# Altium schematic sheet peripherals.SchDoc
size A4; SheetNumber: 2; SheetTotal: 2
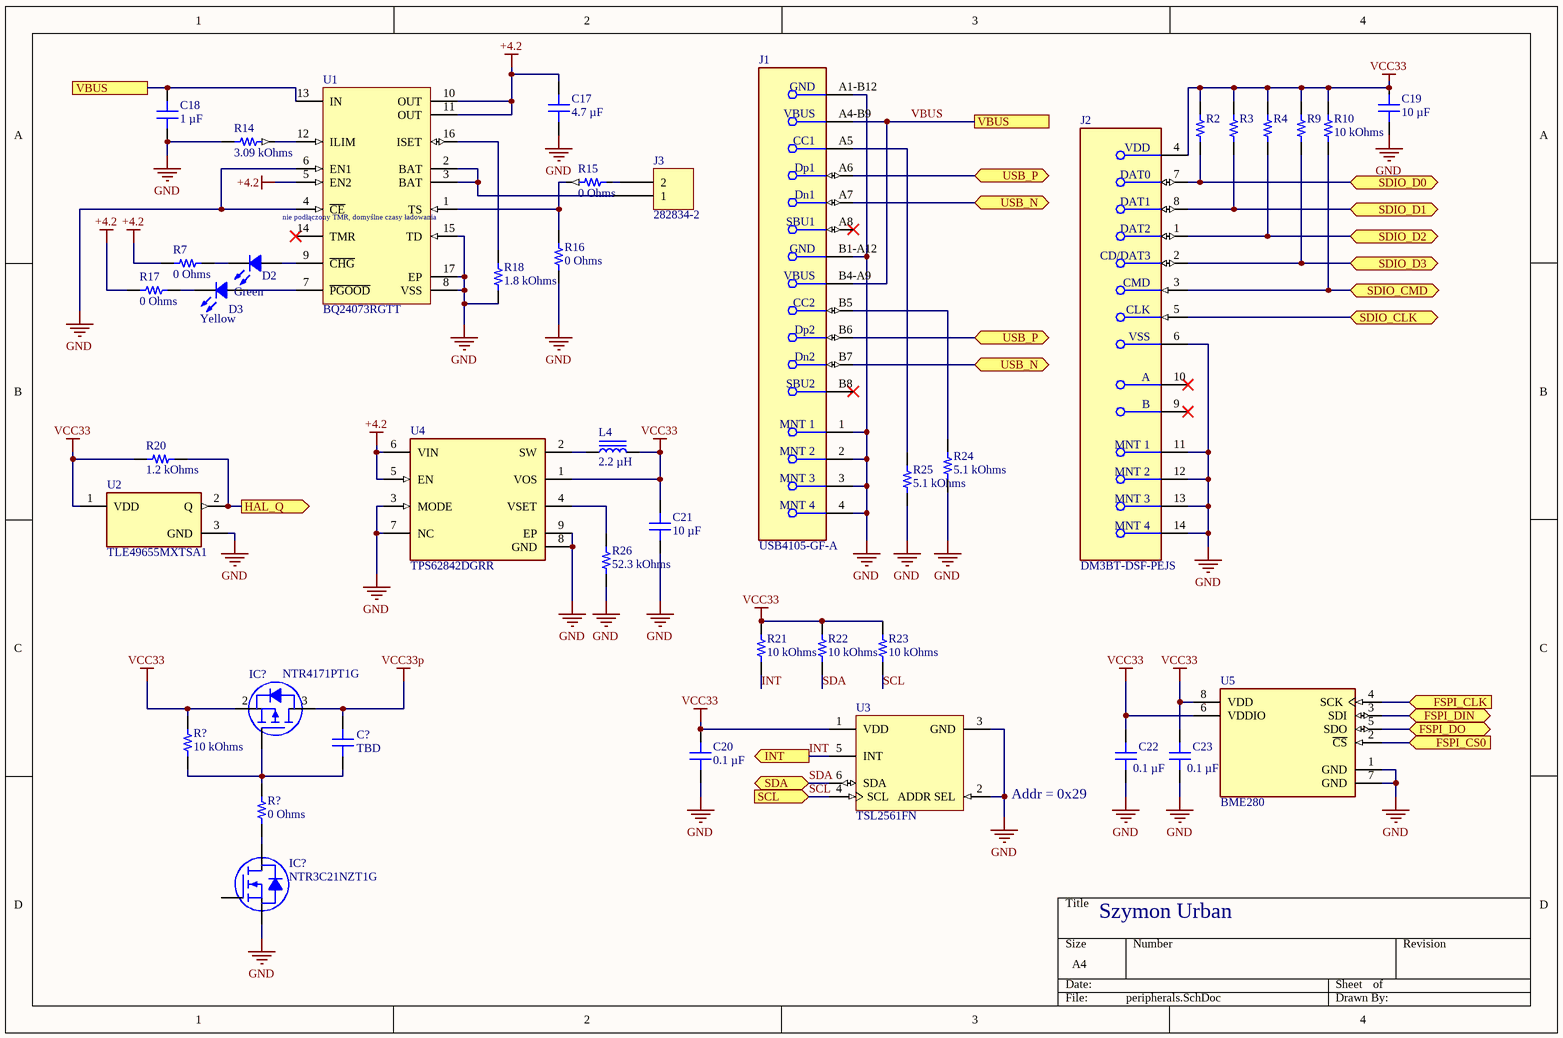
[diagram p0: peripherals.SchDoc]

## Parts
(Parts that share a designator on the sheet are numbered #1, #2 ... from top to bottom, then left to right.)
C17  4.7 µF  [CAP 0603_1608]
C18  1 µF  [CAP 0603_1608]
C19  10 µF  [CAP 0603_1608]
C20  0.1 µF  [CAP 0603_1608]
C21  10 µF  [CAP 0603_1608]
C22  0.1 µF  [CAP 0603_1608]
C23  0.1 µF  [CAP 0603_1608]
C?  TBD  [CAP 0402_1005]
D2  Green  [LED 0805_2012 GREEN]
D3  Yellow  [LED 0805_2012 YELLOW]
IC?#1  NTR4171PT1G  [ON SEMI SOT-23-3]
IC?#2  NTR3C21NZT1G  [ON SEMI SOT-23-3]
J1  USB4105-GF-A  [FP-USB4105-GF-A-MFG]
J2  DM3BT-DSF-PEJS  [FP-DM3BT-DSF-PEJS-MFG]
J3  282834-2  [TE 282834-2]
L4  2.2 µH  [IND 0402_1005 RF WW]
R2  10 kOhms  [RES 0603_1608]  (value not drawn)
R3  10 kOhms  [RES 0603_1608]  (value not drawn)
R4  10 kOhms  [RES 0603_1608]  (value not drawn)
R7  0 Ohms  [RES 0603_1608]
R9  10 kOhms  [RES 0603_1608]  (value not drawn)
R10  10 kOhms  [RES 0603_1608]
R14  3.09 kOhms  [RES 0603_1608]
R15  0 Ohms  [RES 0603_1608]
R16  0 Ohms  [RES 0603_1608]
R17  0 Ohms  [RES 0603_1608]
R18  1.8 kOhms  [RES 0603_1608]
R20  1.2 kOhms  [RES 0603_1608]
R21  10 kOhms  [RES 0603_1608]
R22  10 kOhms  [RES 0603_1608]
R23  10 kOhms  [RES 0603_1608]
R24  5.1 kOhms  [RES 0603_1608]
R25  5.1 kOhms  [RES 0603_1608]
R26  52.3 kOhms  [RES 0603_1608]
R?#1  10 kOhms  [RES 0603_1608]
R?#2  0 Ohms  [RES 0603_1608]
U1  BQ24073RGTT  [RGT0016C_V]
U2  TLE49655MXTSA1  [FP-PG-SOT23-3-MFG]
U3  TSL2561FN  [AMS-FN-6-2000X2000DE_V]
U4  TPS62842DGRR  [FP-DGR0008A-MFG]
U5  BME280  [FP-BME280-MFG]

## Ports
FSPI_CLK (in, see MCU[1D]), FSPI_CS0 (in, see MCU[3C]), FSPI_DIN (bidir, see MCU[1C]), FSPI_DO (bidir, see MCU[1D]), HAL_Q (out, see MCU[3C]), INT (out, see MCU[1D]), SCL (in, see MCU[1D]), SDA (bidir, see MCU[1D]), SDIO_CLK (bidir, see MCU[3B]), SDIO_CMD (bidir, see MCU[3B]), SDIO_D0 (bidir, see MCU[3B]), SDIO_D1 (bidir, see MCU[3B]), SDIO_D2 (bidir, see MCU[3B]), SDIO_D3 (bidir, see MCU[3A]), USB_N (bidir, see MCU[1D], peripherals[3A]), USB_N (bidir, see MCU[1D], peripherals[3B]), USB_P (bidir, see MCU[3C], peripherals[3A]), USB_P (bidir, see MCU[3C], peripherals[3B]), VBUS (see MCU[1D], peripherals[1A]), VBUS (see MCU[1D], peripherals[3A])

## Nets
+4.2: C17.2 R7.2 R17.2 U1.5(EN2) U1.10(OUT) U1.11(OUT) U4.5(EN) U4.6(VIN)
GND: C17.1 C18.1 C19.2 C20.1 C21.2 C22.1 C23.1 IC?#2.2(S) J1.1(MNT_1) J1.2(MNT_2) J1.3(MNT_3) J1.4(MNT_4) J1.A1-B12(GND) J1.B1-A12(GND) J2.6(VSS) J2.11(MNT_1) J2.12(MNT_2) J2.13(MNT_3) J2.14(MNT_4) R14.1 R16.1 R18.1 R24.1 R25.1 R26.1 U1.4(~{CE}) U1.6(EN1) U1.8(VSS) U1.15(TD) U1.17(EP) U2.3(GND) U3.2(ADDR_SEL) U3.3(GND) U4.3(MODE) U4.7(NC) U4.8(GND) U4.9(EP) U5.1(GND) U5.7(GND)
VCC33: C19.1 C20.2 C21.1 C22.2 C23.2 IC?#1.2(S) J2.4(VDD) L4.2 R2.2 R3.2 R4.2 R9.2 R10.2 R20.1 R21.2 R22.2 R23.2 R?#1.2 U2.1(VDD) U3.1(VDD) U4.1(VOS) U5.6(VDDIO) U5.8(VDD)
VCC33p: C?.2 IC?#1.3(D)
FSPI_CLK: U5.4(SCK) ; port FSPI_CLK
FSPI_CS0: U5.2(~{CS}) ; port FSPI_CS0
FSPI_DIN: U5.3(SDI) ; port FSPI_DIN
FSPI_DO: U5.5(SDO) ; port FSPI_DO
HAL_Q: R20.2 U2.2(Q) ; port HAL_Q
INT: R21.1 U3.5(INT) ; port INT
SCL: R23.1 U3.4(SCL) ; port SCL
SDA: R22.1 U3.6(SDA) ; port SDA
SDIO_CLK: J2.5(CLK) ; port SDIO_CLK
SDIO_CMD: J2.3(CMD) R10.1 ; port SDIO_CMD
SDIO_D0: J2.7(DAT0) R2.1 ; port SDIO_D0
SDIO_D1: J2.8(DAT1) R3.1 ; port SDIO_D1
SDIO_D2: J2.1(DAT2) R4.1 ; port SDIO_D2
SDIO_D3: J2.2(CD/DAT3) R9.1 ; port SDIO_D3
USB_N: J1.A7(Dn1) J1.B7(Dn2) ; port USB_N
USB_P: J1.A6(Dp1) J1.B6(Dp2) ; port USB_P
VBUS: C18.2 J1.A4-B9(VBUS) J1.B4-A9(VBUS) U1.13(IN) ; port VBUS
NetC?_1: C?.1 IC?#1.1(G) R?#1.1 R?#2.2
NetD2_1: D2.1 U1.9(~{CHG})
NetD2_2: D2.2 R7.1
NetD3_1: D3.1 U1.7(~{PGOOD})
NetD3_2: D3.2 R17.1
NetIC?#2_3: IC?#2.3(D) R?#2.1
NetJ1_A5: J1.A5(CC1) R25.2
NetJ1_B5: J1.B5(CC2) R24.2
NetJ3_1: J3.1 U1.2(BAT) U1.3(BAT)
NetJ3_2: J3.2 R15.2
NetL4_1: L4.1 U4.2(SW)
NetR14_2: R14.2 U1.12(ILIM)
NetR15_1: R15.1 R16.2 U1.1(TS)
NetR18_2: R18.2 U1.16(ISET)
NetR26_2: R26.2 U4.4(VSET)

Not connected (* = marked no-connect by the designer): IC?#2 1(G); J1 A8(SBU1)* B8(SBU2)*; J2 9(B)* 10(A)*; U1 14(TMR)*

## Notes on the sheet
- (near U1) nie podłączony TMR, domyślne czasy ładowania
- Addr = 0x29
- Szymon Urban

## Library data of the parts
C17 = GRM188R61C475KE11D: CAP CER 4.7UF 16V X5R 0603; manufacturer: Murata Electronics; Tolerance: ±10%; Part Number: GRM188R61C475KE11D; Value: 4.7 µF; Applications: General Purpose; Capacitance: 4.7 µF; componentlink1description: Datasheet; componentlink1url: https://search.murata.co.jp/Ceramy/image/img/A01X/G101/ENG/GRM188R61C475KE11-01.pdf; componentlink2description: DigiKey Link; componentlink2url: https://www.digikey.com/en/products/detail/murata-electronics/GRM188R61C475KE11D/4905341; Device Package: 0603 (1608 Metric); lastupdated: 15.01.2024 20:10:04; Lifecycle Status: Active; Minimum Order: 1; Mounting Type: Surface Mount, MLCC; Operating Temperature: -55°C ~ 85°C; Package / Case: 0603 (1608 Metric); packaging: TapeAndReel; partid: 2388; Part Status: Active; price: 0.03; series: GRM; Size / Dimension: 0.063" L x 0.031" W (1.60mm x 0.80mm); Supplier 1: DigiKey; Supplier Part Number 1: 490-10730-1-ND; Temperature Coefficient: X5R; Thickness (Max): 0.037" (0.95mm); Voltage - Rated: 16V
C18 = CC0603KRX7R6BB105: CAP CER 1UF 10V X7R 0603; manufacturer: Yageo; Tolerance: ±10%; Part Number: CC0603KRX7R6BB105; Value: 1 µF; Applications: General Purpose; Capacitance: 1 µF; componentlink1description: Datasheet; componentlink1url: https://www.yageo.com/upload/media/product/productsearch/datasheet/mlcc/UPY-GPHC_X7R_6.3V-to-50V_18.pdf; componentlink2description: DigiKey Link; componentlink2url: https://www.digikey.com/en/products/detail/yageo/CC0603KRX7R6BB105/5195204; Device Package: 0603 (1608 Metric); lastupdated: 15.01.2024 20:10:05; Lifecycle Status: Active; Minimum Order: 1; Mounting Type: Surface Mount, MLCC; Operating Temperature: -55°C ~ 125°C; Package / Case: 0603 (1608 Metric); packaging: TapeAndReel; partid: 2290; Part Status: Active; price: 0.01; series: CC; Size / Dimension: 0.063" L x 0.031" W (1.60mm x 0.80mm); Supplier 1: DigiKey; Supplier Part Number 1: 311-1796-1-ND; Temperature Coefficient: X7R; Thickness (Max): 0.035" (0.90mm); Voltage - Rated: 10V
C19 C21 = GRM188D71A106KA73D: CAP CER 10UF 10V X7T 0603; manufacturer: Murata Electronics; Tolerance: ±10%; Part Number: GRM188D71A106KA73D; Value: 10 µF; Applications: General Purpose; Capacitance: 10 µF; componentlink1description: Datasheet; componentlink1url: https://search.murata.co.jp/Ceramy/image/img/A01X/G101/ENG/GRM188D71A106KA73-01.pdf; componentlink2description: DigiKey Link; componentlink2url: https://www.digikey.com/en/products/detail/murata-electronics/GRM188D71A106KA73D/6606090; Device Package: 0603 (1608 Metric); lastupdated: 15.01.2024 20:10:04; Lifecycle Status: Active; Minimum Order: 1; Mounting Type: Surface Mount, MLCC; Operating Temperature: -55°C ~ 125°C; Package / Case: 0603 (1608 Metric); packaging: TapeAndReel; partid: 2489; Part Status: Active; price: 0.03; series: GRM; Size / Dimension: 0.063" L x 0.031" W (1.60mm x 0.80mm); Supplier 1: DigiKey; Supplier Part Number 1: 490-14461-1-ND; Temperature Coefficient: X7T; Thickness (Max): 0.039" (1.00mm); Voltage - Rated: 10V
C20 C22 C23 = CS0603KRX7R7BB104: CAP CER 0.1UF 16V X7R 0603; manufacturer: Yageo; Tolerance: ±10%; Part Number: CS0603KRX7R7BB104; Value: 0.1 µF; Applications: Boardflex Sensitive; Capacitance: 0.1 µF; componentlink1description: Datasheet; componentlink1url: http://www.yageo.com/NewPortal/yageodocoutput?fileName=/pdf/MLCC/UPY-ST_NPOX7R_16V-to-3KV_5.pdf; componentlink2description: DigiKey Link; componentlink2url: https://www.digikey.com/en/products/detail/yageo/CS0603KRX7R7BB104/6097897; Device Package: 0603 (1608 Metric); Features: Soft Termination; lastupdated: 15.01.2024 20:10:05; Lifecycle Status: Active; Minimum Order: 1; Mounting Type: Surface Mount, MLCC; Operating Temperature: -55°C ~ 125°C; Package / Case: 0603 (1608 Metric); packaging: TapeAndReel; partid: 2286; Part Status: Active; price: 0.01; series: CS; Size / Dimension: 0.063" L x 0.031" W (1.60mm x 0.80mm); Supplier 1: DigiKey; Supplier Part Number 1: 311-3560-1-ND; Temperature Coefficient: X7R; Thickness (Max): 0.037" (0.95mm); Voltage - Rated: 16V
C? = 04023A6R8CAT2A: CAP CER 6.8PF 25V C0G/NP0 0402; manufacturer: AVX Corporation; Temperature Coefficient: C0G, NP0; Tolerance: ±0.25pF; Part Number: 04023A6R8CAT2A; Value: TBD; Applications: General Purpose; Capacitance: 6.8pF; componentlink1description: Datasheet; componentlink1url: http://datasheets.avx.com/C0GNP0-Dielectric.pdf; componentlink2description: DigiKey Link; componentlink2url: http://digikey.com/product-detail/en/avx-corporation/04023A6R8CAT2A/478-12617-1-ND/9949155; Device Package: 0402 (1005 Metric); lastupdated: 08.02.2022 12:26:50; Lifecycle Status: Active; Minimum Order: 1; Mounting Type: Surface Mount, MLCC; Operating Temperature: -55°C ~ 125°C; Package / Case: 0402 (1005 Metric); packaging: TapeAndReel; partid: 6987; Part Status: Active; price: 0.06; series: -; Size / Dimension: 0.039" L x 0.020" W (1.00mm x 0.50mm); Supplier 1: DigiKey; Supplier Part Number 1: 478-12617-1-ND; Thickness (Max): 0.022" (0.56mm); Voltage - Rated: 25V
D2 = 150080VS75000: LED GREEN CLEAR 0805 SMD; Manufacturer: Würth Elektronik; Configuration: Standard; Current - Test: 20mA; Lens Color: Colorless; Lens Size: 1.40mm x 1.25mm; Lens Style: Rectangle with Flat Top; Millicandela Rating: 40mcd; Viewing Angle: 140°; Voltage - Forward (Vf) (Typ): 2V; Wavelength - Dominant: 570nm; Wavelength - Peak: 572nm; Part Number: 150080VS75000; Color: Green; ComponentLink1Description: Datasheet; ComponentLink1URL: https://katalog.we-online.de/led/datasheet/150080VS75000.pdf; ComponentLink2Description: DigiKey Link; ComponentLink2URL: https://www.digikey.com/en/products/detail/würth-elektronik/150080VS75000/4489924; Device Package: 0805 (2012 Metric); Height (Max): 0.80mm; LastUpdated: 15.01.2024 21:31:06; Lens Transparency: Clear; Lifecycle Status: Active; Minimum Order: 1; Mounting Type: Surface Mount; Package / Case: 0805 (2012 Metric); Packaging: TapeAndReel; PartId: 300; Part Status: Active; Price: 0.13; Series: WL-SMCW; Size / Dimension: 2.00mm L x 1.25mm W; Supplier 1: DigiKey; Supplier Part Number 1: 732-4986-1-ND; Supplier Device Package: 0805; Value: Green
D3 = 150080YS75000: LED YELLOW CLEAR 0805 SMD; Manufacturer: Würth Elektronik; Configuration: Standard; Current - Test: 20mA; Lens Color: Colorless; Lens Size: 1.40mm x 1.25mm; Lens Style: Rectangle with Flat Top; Millicandela Rating: 120mcd; Viewing Angle: 140°; Voltage - Forward (Vf) (Typ): 2V; Wavelength - Dominant: 590nm; Wavelength - Peak: 595nm; Part Number: 150080YS75000; Color: Yellow; ComponentLink1Description: Datasheet; ComponentLink1URL: https://katalog.we-online.de/led/datasheet/150080YS75000.pdf; ComponentLink2Description: DigiKey Link; ComponentLink2URL: https://www.digikey.com/en/products/detail/würth-elektronik/150080YS75000/4489927; Device Package: 0805 (2012 Metric); Height (Max): 0.80mm; LastUpdated: 15.01.2024 21:32:02; Lens Transparency: Clear; Lifecycle Status: Active; Minimum Order: 1; Mounting Type: Surface Mount; Package / Case: 0805 (2012 Metric); Packaging: TapeAndReel; PartId: 56; Part Status: Active; Price: 0.13; Series: WL-SMCW; Size / Dimension: 2.00mm L x 1.25mm W; Supplier 1: DigiKey; Supplier Part Number 1: 732-4987-1-ND; Supplier Device Package: 0805; Value: Yellow
IC?#1 = NTR4171PT1G: MOSFET P-CH 30V 2.2A SOT23; Manufacturer: ON Semiconductor; Current - Continuous Drain (Id) @ 25°C: 2.2A (Ta); Drive Voltage (Max Rds On,  Min Rds On): 2.5V, 10V; FET Type: P-Channel; Gate Charge (Qg) (Max) @ Vgs: 15.6nC @ 10V; Input Capacitance (Ciss) (Max) @ Vds: 720pF @ 15V; Power Dissipation (Max): 480mW (Ta); Rds On (Max) @ Id, Vgs: 75mOhm @ 2.2A, 10V; Vgs (Max): ±12V; Vgs(th) (Max) @ Id: 1.4V @ 250µA; Part Number: NTR4171PT1G; ComponentLink1Description: Datasheet; ComponentLink1URL: http://www.onsemi.com/pub/Collateral/NTR4171P-D.PDF; ComponentLink2Description: DigiKey Link; ComponentLink2URL: http://digikey.com/product-detail/en/on-semiconductor/NTR4171PT1G/NTR4171PT1GOSCT-ND/2705209; Drain to Source Voltage (Vdss): 30V; LastUpdated: 08.02.2024 21:46:19; Lifecycle Status: Active; Minimum Order: 1; Mounting Type: Surface Mount; Operating Temperature: -55°C ~ 150°C (TJ); Package / Case: TO-236-3, SC-59, SOT-23-3; Packaging: TapeAndReel; Part Status: Active; Price: 0.10; Series: -; Supplier 1: DigiKey; Supplier Part Number 1: NTR4171PT1GOSCT-ND; Supplier Device Package: SOT-23-3 (TO-236); Technology: MOSFET (Metal Oxide)
IC?#2 = NTR3C21NZT1G: MOSFET N-CH 20V 3.6A SOT23-3; Manufacturer: ON Semiconductor; Current - Continuous Drain (Id) @ 25°C: 3.6A (Ta); Drive Voltage (Max Rds On,  Min Rds On): 1.8V, 4.5V; FET Type: N-Channel; Gate Charge (Qg) (Max) @ Vgs: 17.8nC @ 4.5V; Input Capacitance (Ciss) (Max) @ Vds: 1540pF @ 16V; Power Dissipation (Max): 470mW (Ta); Rds On (Max) @ Id, Vgs: 24mOhm @ 5A, 4.5V; Vgs (Max): ±8V; Vgs(th) (Max) @ Id: 1V @ 250µA; Part Number: NTR3C21NZT1G; ComponentLink1Description: Datasheet; ComponentLink1URL: http://www.onsemi.com/pub/Collateral/NTR3C21NZ-D.PDF; ComponentLink2Description: DigiKey Link; ComponentLink2URL: http://digikey.com/product-detail/en/on-semiconductor/NTR3C21NZT1G/NTR3C21NZT1GOSCT-ND/9087577; Drain to Source Voltage (Vdss): 20V; LastUpdated: 08.02.2024 21:46:18; Lifecycle Status: Active; Minimum Order: 1; Mounting Type: Surface Mount; Operating Temperature: -55°C ~ 150°C (TJ); Package / Case: TO-236-3, SC-59, SOT-23-3; Packaging: TapeAndReel; Part Status: Active; Price: 0.10; Series: -; Supplier 1: DigiKey; Supplier Part Number 1: NTR3C21NZT1GOSCT-ND; Supplier Device Package: SOT-23-3 (TO-236); Technology: MOSFET (Metal Oxide)
J1 = CMP-245163-000001-1: CONN RCPT USB2.0 TYPEC 5A; Manufacturer: GCT; Voltage Rating: 20V; Is Female: yes; Current Rating: 5/6.25/1.25/0.25A; Number Of Contacts: 16; Conn Orientation: Right Angle; Device Class L1: Connectors; Category: Conn; Lead Free: Yes; RoHS: TRUE; Temperature Range High: +85°C; Digikey Description: CONN RCPT USB2.0 TYPEC 5A; Device Class L3: unset; ComponentLink2Description: Datasheet; Manufacturer Part Number: USB4105-GF-A; Package: 0; Usb Standard: USB 2.0; Device Class L2: USB Connectors; Automotive: No; Temperature Range Low: -40°C; Height: 3.46mm; Temperature: -40°C to +85°C; Contact Material: Gold,Nickel; ComponentLink2URL: https://gct.co/files/drawings/usb4105.pdf; Octopart: https://octopart.com/usb4105-gf-a-gct-106627878
J2 = CMP-11597-000004-1: CONN MICRO SD CARD PUSH-PUSH R/A; Connector Type: Connector; Pitch: 1.1mm; Insulation Resistance: 1GR; Contact Resistance: 100mR; Number of Positions: 8; Max Voltage Rating (AC): 125V; Gender: Female; Current Rating: 500mA; Flammability Rating: UL94 V-0; Min Operating Temperature: -25°C; Lead Free: Lead Free; Length: 13.85mm; Radiation Hardening: No; Orientation: Right Angle; Mount: Surface Mount; Housing Material: Polymer; Contact Material: Copper Alloy; Package Quantity: 1; Contact Plating: Gold; Termination: Solder; Max Operating Temperature: 85°C; Number of Contacts: 8; Voltage Rating (AC): 125V; REACH SVHC: No SVHC; Depth: 1.83mm; Max Current Rating: 500mA; Width: 16.05mm; Number of Rows: 1; Packaging: Tape and Reel
J3 = 282834-2: TERM BLK 2P SIDE ENT 2.54MM PCB; Manufacturer: TE Connectivity AMP Connectors; Current: 10A; Mating Orientation: Horizontal with Board; Number of Levels: 1; Pitch: 0.100" (2.54mm); Positions Per Level: 2; Voltage: 150V; Wire Gauge: 16-30 AWG; Wire Termination: Screw - Rising Cage Clamp; Part Number: 282834-2; Color: Green; ComponentLink1Description: Datasheet; ComponentLink1URL: https://www.te.com/commerce/DocumentDelivery/DDEController?Action=srchrtrv&DocNm=282834&DocType=Customer+Drawing&DocLang=English; ComponentLink2Description: DigiKey Link; ComponentLink2URL: http://digikey.com/product-detail/en/te-connectivity-amp-connectors/282834-2/A98333-ND/1150135; LastUpdated: 15.01.2020 04:15:38; Lifecycle Status: Active; Minimum Order: 1; Mounting Type: Through Hole; Packaging: Bulk; Part Status: Active; Price: 0.88; Series: Buchanan; Supplier 1: DigiKey; Supplier Part Number 1: A98333-ND
L4 = LQW15CE2R2M10D: FIXED IND 2.2UH 85MA 1.8OHM SMD; Manufacturer: Murata Electronics; DC Resistance (DCR): 1.8Ohm Max; Frequency - Self Resonant: 100MHz; Inductance Frequency - Test: 1 MHz; Material - Core: Ferrite; Shielding: Unshielded; Tolerance: ±20%; Type: Drum Core, Wirewound; Part Number: LQW15CE2R2M10D; ComponentLink1Description: Datasheet; ComponentLink1URL: https://search.murata.co.jp/Ceramy/image/img/P02/JELF243A-0187.pdf; ComponentLink2Description: DigiKey Link; ComponentLink2URL: https://www.digikey.com/en/products/detail/murata-electronics/LQW15CE2R2M10D/15843704; Current Rating (Amps): 85 mA; Device Package: 0402 (1005 Metric); Height - Seated (Max): 0.024" (0.60mm); Inductance: 2.2 µH; LastUpdated: 15.01.2024 21:33:44; Lifecycle Status: Active; Minimum Order: 1; Mounting Type: Surface Mount; Operating Temperature: -55°C ~ 125°C; Package / Case: 0402 (1005 Metric); Packaging: TapeAndReel; PartId: 1541; Part Status: Active; Price: 0.07; Series: LQW15; Size / Dimension: 0.039" L x 0.024" W (1.00mm x 0.60mm); Supplier 1: DigiKey; Supplier Part Number 1: 490-LQW15CE2R2M10DDKR-ND; Supplier Device Package: 0402; Value: 2.2 µH
R2-R4 R9 R10 R21-R23 = RT0603FRE0710KL: RES SMD 10K OHM 1% 1/10W 0603; Manufacturer: Yageo; Power (Watts): 0.1W, 1/10W; Temperature Coefficient: ±50ppm/°C; Part Number: RT0603FRE0710KL; Value: 10 kOhms; ComponentLink1Description: Datasheet; ComponentLink1URL: https://www.yageo.com/upload/media/product/productsearch/datasheet/rchip/PYu-RT_1-to-0.01_RoHS_L_11.pdf; ComponentLink2Description: DigiKey Link; ComponentLink2URL: https://www.digikey.com/en/products/detail/yageo/RT0603FRE0710KL/1075040; Composition: Thin Film; Device Package: 0603 (1608 Metric); Height - Seated (Max): 0.022" (0.55mm); LastUpdated: 15.01.2024 20:40:25; Lifecycle Status: Active; Minimum Order: 1; Number of Terminations: 2; Operating Temperature: -55°C ~ 155°C; Package / Case: 0603 (1608 Metric); Packaging: TapeAndReel; PartId: 5671; Part Status: Active; Price: 0.01; Resistance: 10 kOhms; Series: RT; Size / Dimension: 0.063" L x 0.031" W (1.60mm x 0.80mm); Supplier 1: DigiKey; Supplier Part Number 1: YAG2321CT-ND; Supplier Device Package: 0603; Tolerance: ±1%
R7 R15-R17 R?#2 = JR0603X26E: 0603 26 AMP JUMPER; Manufacturer: Ohmite; Power (Watts): 0.135W; Part Number: JR0603X26E; Value: 0 Ohms; ComponentLink1Description: Datasheet; ComponentLink1URL: https://www.ohmite.com/assets/docs/res_jr.pdf?r=false; ComponentLink2Description: DigiKey Link; ComponentLink2URL: https://www.digikey.com/en/products/detail/ohmite/JR0603X26E/10233371; Composition: Metal Element; Device Package: 0603 (1608 Metric); Height - Seated (Max): 0.022" (0.55mm); LastUpdated: 15.01.2024 20:40:20; Lifecycle Status: Active; Minimum Order: 1; Number of Terminations: 2; Operating Temperature: -55°C ~ 150°C; Package / Case: 0603 (1608 Metric); Packaging: TapeAndReel; PartId: 6812; Part Status: Active; Price: 0.10; Resistance: 0 Ohms; Series: JR; Size / Dimension: 0.063" L x 0.031" W (1.60mm x 0.80mm); Supplier 1: DigiKey; Supplier Part Number 1: JR0603X26ECT-ND; Supplier Device Package: 0603; Tolerance: Jumper
R14 = RMCF0603FT3K09: RES 3.09K OHM 1% 1/10W 0603; Manufacturer: Stackpole Electronics Inc; Power (Watts): 0.1W, 1/10W; Temperature Coefficient: ±100ppm/°C; Part Number: RMCF0603FT3K09; Value: 3.09 kOhms; ComponentLink1Description: Datasheet; ComponentLink1URL: https://www.seielect.com/catalog/sei-rmcf_rmcp.pdf; ComponentLink2Description: DigiKey Link; ComponentLink2URL: https://www.digikey.com/en/products/detail/stackpole-electronics-inc/RMCF0603FT3K09/1761340; Composition: Thick Film; Device Package: 0603 (1608 Metric); Features: Automotive AEC-Q200; Height - Seated (Max): 0.022" (0.55mm); LastUpdated: 15.01.2024 20:39:25; Lifecycle Status: Active; Minimum Order: 1; Number of Terminations: 2; Operating Temperature: -55°C ~ 155°C; Package / Case: 0603 (1608 Metric); Packaging: CutTape; PartId: 20368; Part Status: Active; Price: 0.01; Ratings: AEC-Q200; Resistance: 3.09 kOhms; Series: RMCF; Size / Dimension: 0.061" L x 0.031" W (1.55mm x 0.80mm); Supplier 1: DigiKey; Supplier Part Number 1: RMCF0603FT3K09CT-ND; Supplier Device Package: 0603; Tolerance: ±1%
R18 = RMCF0603JG1K80: RES 1.8K OHM 5% 1/10W 0603; Manufacturer: Stackpole Electronics Inc; Power (Watts): 0.1W, 1/10W; Temperature Coefficient: ±200ppm/°C; Part Number: RMCF0603JG1K80; Value: 1.8 kOhms; ComponentLink1Description: Datasheet; ComponentLink1URL: https://www.seielect.com/catalog/sei-packaging.pdf; ComponentLink2Description: DigiKey Link; ComponentLink2URL: https://www.digikey.com/en/products/detail/stackpole-electronics-inc/RMCF0603JG1K80/1712125; Composition: Thick Film; Device Package: 0603 (1608 Metric); Features: Automotive AEC-Q200; Height - Seated (Max): 0.022" (0.55mm); LastUpdated: 15.01.2024 20:39:16; Lifecycle Status: Active; Minimum Order: 1; Number of Terminations: 2; Operating Temperature: -55°C ~ 155°C; Package / Case: 0603 (1608 Metric); Packaging: CutTape; PartId: 22440; Part Status: Active; Price: 0.01; Ratings: AEC-Q200; Resistance: 1.8 kOhms; Series: RMCF; Size / Dimension: 0.061" L x 0.031" W (1.55mm x 0.80mm); Supplier 1: DigiKey; Supplier Part Number 1: RMCF0603JG1K80CT-ND; Supplier Device Package: 0603; Tolerance: ±5%
R20 = RC0603FR-131K2L: RES 1.2K OHM 1% 1/10W 0603; Manufacturer: Yageo; Power (Watts): 0.1W, 1/10W; Temperature Coefficient: ±100ppm/°C; Part Number: RC0603FR-131K2L; Value: 1.2 kOhms; ComponentLink1Description: Datasheet; ComponentLink1URL: https://www.yageo.com/upload/media/product/productsearch/datasheet/rchip/PYu-RC_Group_51_RoHS_L_11.pdf; ComponentLink2Description: DigiKey Link; ComponentLink2URL: https://www.digikey.com/en/products/detail/yageo/RC0603FR-131K2L/14008161; Composition: Thick Film; Device Package: 0603 (1608 Metric); Height - Seated (Max): 0.022" (0.55mm); LastUpdated: 15.01.2024 20:38:11; Lifecycle Status: Active; Minimum Order: 1; Number of Terminations: 2; Operating Temperature: -55°C ~ 155°C; Package / Case: 0603 (1608 Metric); Packaging: CutTape; PartId: 65573; Part Status: Active; Price: 0.01; Resistance: 1.2 kOhms; Series: RC_L; Size / Dimension: 0.063" L x 0.031" W (1.60mm x 0.80mm); Supplier 1: DigiKey; Supplier Part Number 1: 13-RC0603FR-131K2LCT-ND; Supplier Device Package: 0603; Tolerance: ±1%
R24 R25 = RR0816P-512-D: RES SMD 5.1K OHM 0.5% 1/16W 0603; Manufacturer: Susumu; Power (Watts): 0.063W, 1/16W; Temperature Coefficient: ±25ppm/°C; Part Number: RR0816P-512-D; Value: 5.1 kOhms; ComponentLink1Description: Datasheet; ComponentLink1URL: http://www.susumu.co.jp/common/pdf/n_catalog_partition05_en.pdf; ComponentLink2Description: DigiKey Link; ComponentLink2URL: https://www.digikey.com/en/products/detail/susumu/RR0816P-512-D/432202; Composition: Thin Film; Device Package: 0603 (1608 Metric); Height - Seated (Max): 0.020" (0.50mm); LastUpdated: 15.01.2024 20:39:40; Lifecycle Status: Active; Minimum Order: 1; Number of Terminations: 2; Operating Temperature: -55°C ~ 125°C; Package / Case: 0603 (1608 Metric); Packaging: TapeAndReel; PartId: 16877; Part Status: Active; Price: 0.01; Resistance: 5.1 kOhms; Series: RR; Size / Dimension: 0.063" L x 0.031" W (1.60mm x 0.80mm); Supplier 1: DigiKey; Supplier Part Number 1: RR08P5.1KDCT-ND; Supplier Device Package: 0603; Tolerance: ±0.5%
R26 = RC0603FR-1052K3L: RES 52.3K OHM 1% 1/10W 0603; Manufacturer: Yageo; Power (Watts): 0.1W, 1/10W; Temperature Coefficient: ±100ppm/°C; Part Number: RC0603FR-1052K3L; Value: 52.3 kOhms; ComponentLink1Description: Datasheet; ComponentLink1URL: https://www.yageo.com/upload/media/product/productsearch/datasheet/rchip/PYu-RC_Group_51_RoHS_L_11.pdf; ComponentLink2Description: DigiKey Link; ComponentLink2URL: https://www.digikey.com/en/products/detail/yageo/RC0603FR-1052K3L/14008206; Composition: Thick Film; Device Package: 0603 (1608 Metric); Height - Seated (Max): 0.022" (0.55mm); LastUpdated: 15.01.2024 20:38:08; Lifecycle Status: Active; Minimum Order: 1; Number of Terminations: 2; Operating Temperature: -55°C ~ 155°C; Package / Case: 0603 (1608 Metric); Packaging: CutTape; PartId: 65325; Part Status: Active; Price: 0.01; Resistance: 52.3 kOhms; Series: RC_L; Size / Dimension: 0.063" L x 0.031" W (1.60mm x 0.80mm); Supplier 1: DigiKey; Supplier Part Number 1: 13-RC0603FR-1052K3LCT-ND; Supplier Device Package: 0603; Tolerance: ±1%
R?#1 = TNPW060310K0FHTA: RES 10K OHM 1% 1/10W 0603; Manufacturer: Vishay Dale; Power (Watts): 0.1W, 1/10W; Temperature Coefficient: ±50ppm/°C; Part Number: TNPW060310K0FHTA; Value: 10 kOhms; ComponentLink2Description: DigiKey Link; ComponentLink2URL: https://www.digikey.com/en/products/detail/vishay-dale/TNPW060310K0FHTA/7354881; Composition: Thin Film; Device Package: 0603 (1608 Metric); Features: Military; Height - Seated (Max): 0.022" (0.55mm); LastUpdated: 09.02.2024 20:43:19; Lifecycle Status: Active; Minimum Order: 1; Number of Terminations: 2; Operating Temperature: -55°C ~ 125°C; Package / Case: 0603 (1608 Metric); Packaging: TapeAndReel; PartId: 9361; Part Status: Active; Price: 0.09; Resistance: 10 kOhms; Series: TNPW; Size / Dimension: 0.063" L x 0.033" W (1.60mm x 0.85mm); Supplier 1: DigiKey; Supplier Part Number 1: 541-3906-1-ND; Supplier Device Package: 0603; Tolerance: ±1%
U1 = CMP-0321-00214-2: USB-Friendly Li-Ion Battery Charger and Power-Path Management IC, Vout 4.4 V, 4.3 V, -40 to 85 degC, 16-pin QFN (RGT), Green (RoHS & no Sb/Br); Manufacturer: Texas Instruments; Over Voltage Protection: N; SubFamily: Battery Charge Management; Vin(Min)(V): 4.3; Mounting Technology: Surface Mount; Lead Acid: N; NiCd: N; Eco-Plan: Green (RoHS & no Sb/Br); Code_JEDEC: MO-220; ComponentLink1Description: Datasheet; DatasheetVersion: SLUS810G; NiMH: N; PackageReference: RGT0016C; PartNumber: BQ24073RGTT; ComponentLink1URL: http://www.ti.com/general/docs/lit/getliterature.tsp?genericPartNumber=BQ24073&fileType=pdf; PackageDescription: 16-Pin Plastic Quad Flat No-Lead, 3 x 3 mm Body, 0.5 mm Pitch, 1.7 x 1.7 mm Exposed Pad; Li-Polymer: N; PackageVersion: revH, Oct-2011; Li-Ion: N
U2 = CMP-00196-59660426-1: TLE49655MXTSA1 Hall Effect Sensor 5mA Unipolar 3.3V/5V Automotive 3-Pin SOT-23 T/R; Polarity: South Pole; Operating Supply Voltage: 5.5V; Max Supply Current: 1.4mA; NexarPartId: 59660426; Min Operating Temperature: -40°C; RoHS: Compliant; Case/Package: SOT-23; Schedule B: 8542390000, 8542390000; Max Output Current: 5mA; Number of Pins: 3; Package Quantity: 3000; Max Operating Temperature: 170°C; Lifecycle Status: Production; Sensing Method: Hall Effect; Mount: Surface Mount; Packaging: Tape & Reel
U3 = CMP-0550-00041-2: Light-to-Digital Converter, 2.7 to 3.6 V, FN-6, Pb-Free, Reel; Manufacturer: AMS; Interface: I2C - 1.8; Maximum Lux: 40000; Programmable: Gain, Integration Time , Interrupt; Supply Voltage (V): 2.7 - 3.6; ComponentLink2URL: http://www.ams.com/eng/content/download/250096/975518/143687; PackageDescription: 6-Pin Dual Flat No-Lead, 2 x 2 mm Body, 0.65 mm Pitch; PackageReference: FN-6; ComponentLink1Description: Manufacturer URL; ComponentLink2Description: Datasheet; PartNumber: TSL2561FN; ComponentLink1URL: www.ams.com; PackageVersion: TAOS059Q, 11/2009; DatasheetVersion: TAOS059Q; Mounting Technology: Surface Mount
U4 = CMP-04918-000211-1: STEP DOWN CONVERTER; RoHS Compliant: Yes
U5 = CMP-2000-05073-3: SENSOR PRESSURE HUMIDITY TEMP; Sensor Type: Temperature; Accuracy: 3%; Response Time: 1s; Output Type: SPI; Min Operating Temperature: -40°C; Max Operating Temperature: 85°C; Case/Package: LGA; Packaging: Cut Tape; Mount: Surface Mount; Lead Free: Lead Free; Number of Pins: 8